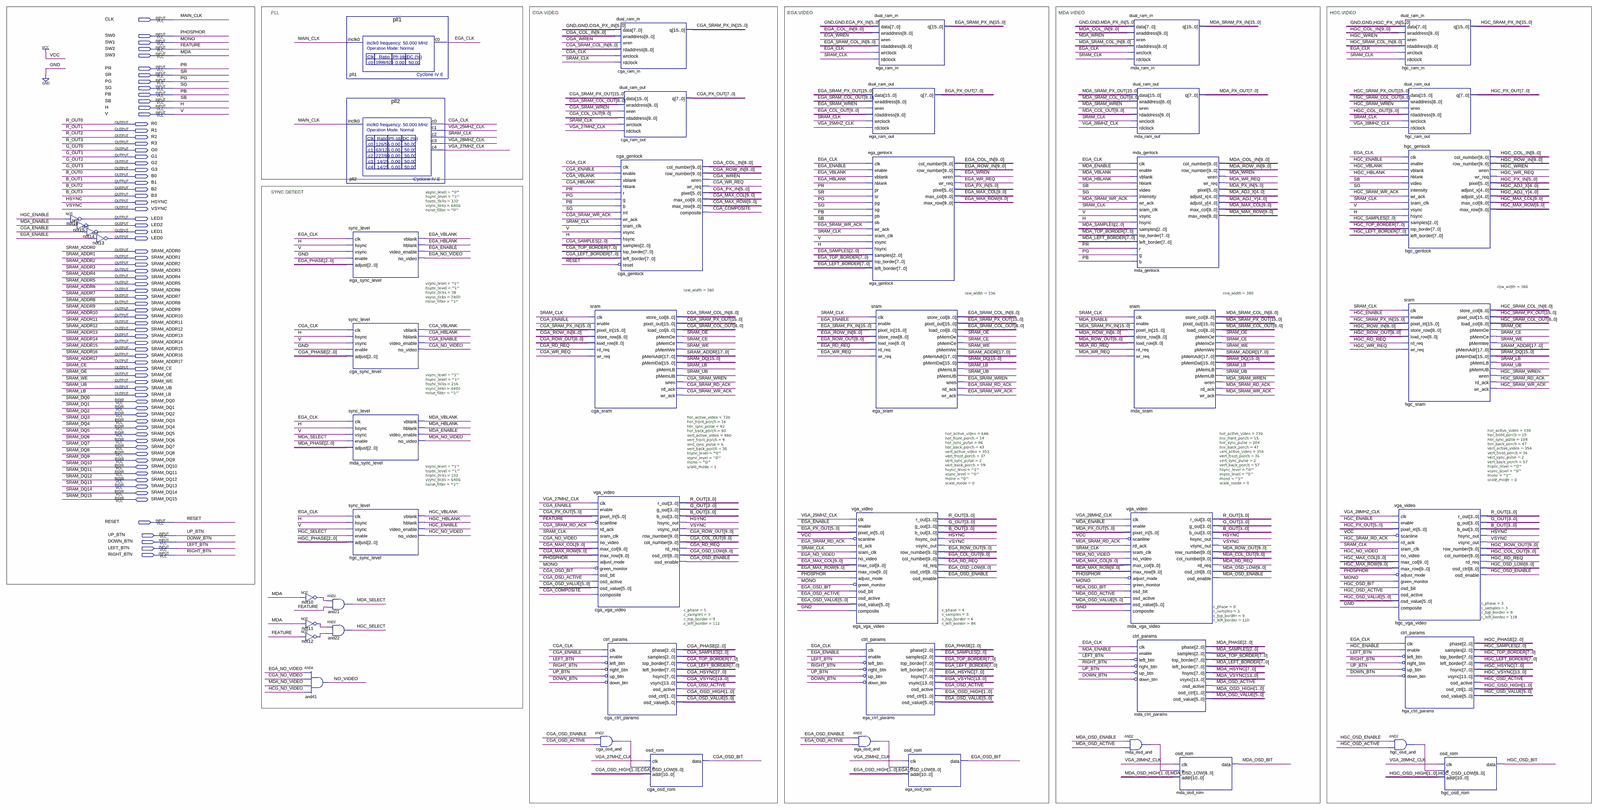
[diagram p0: schematic sheet, whole]
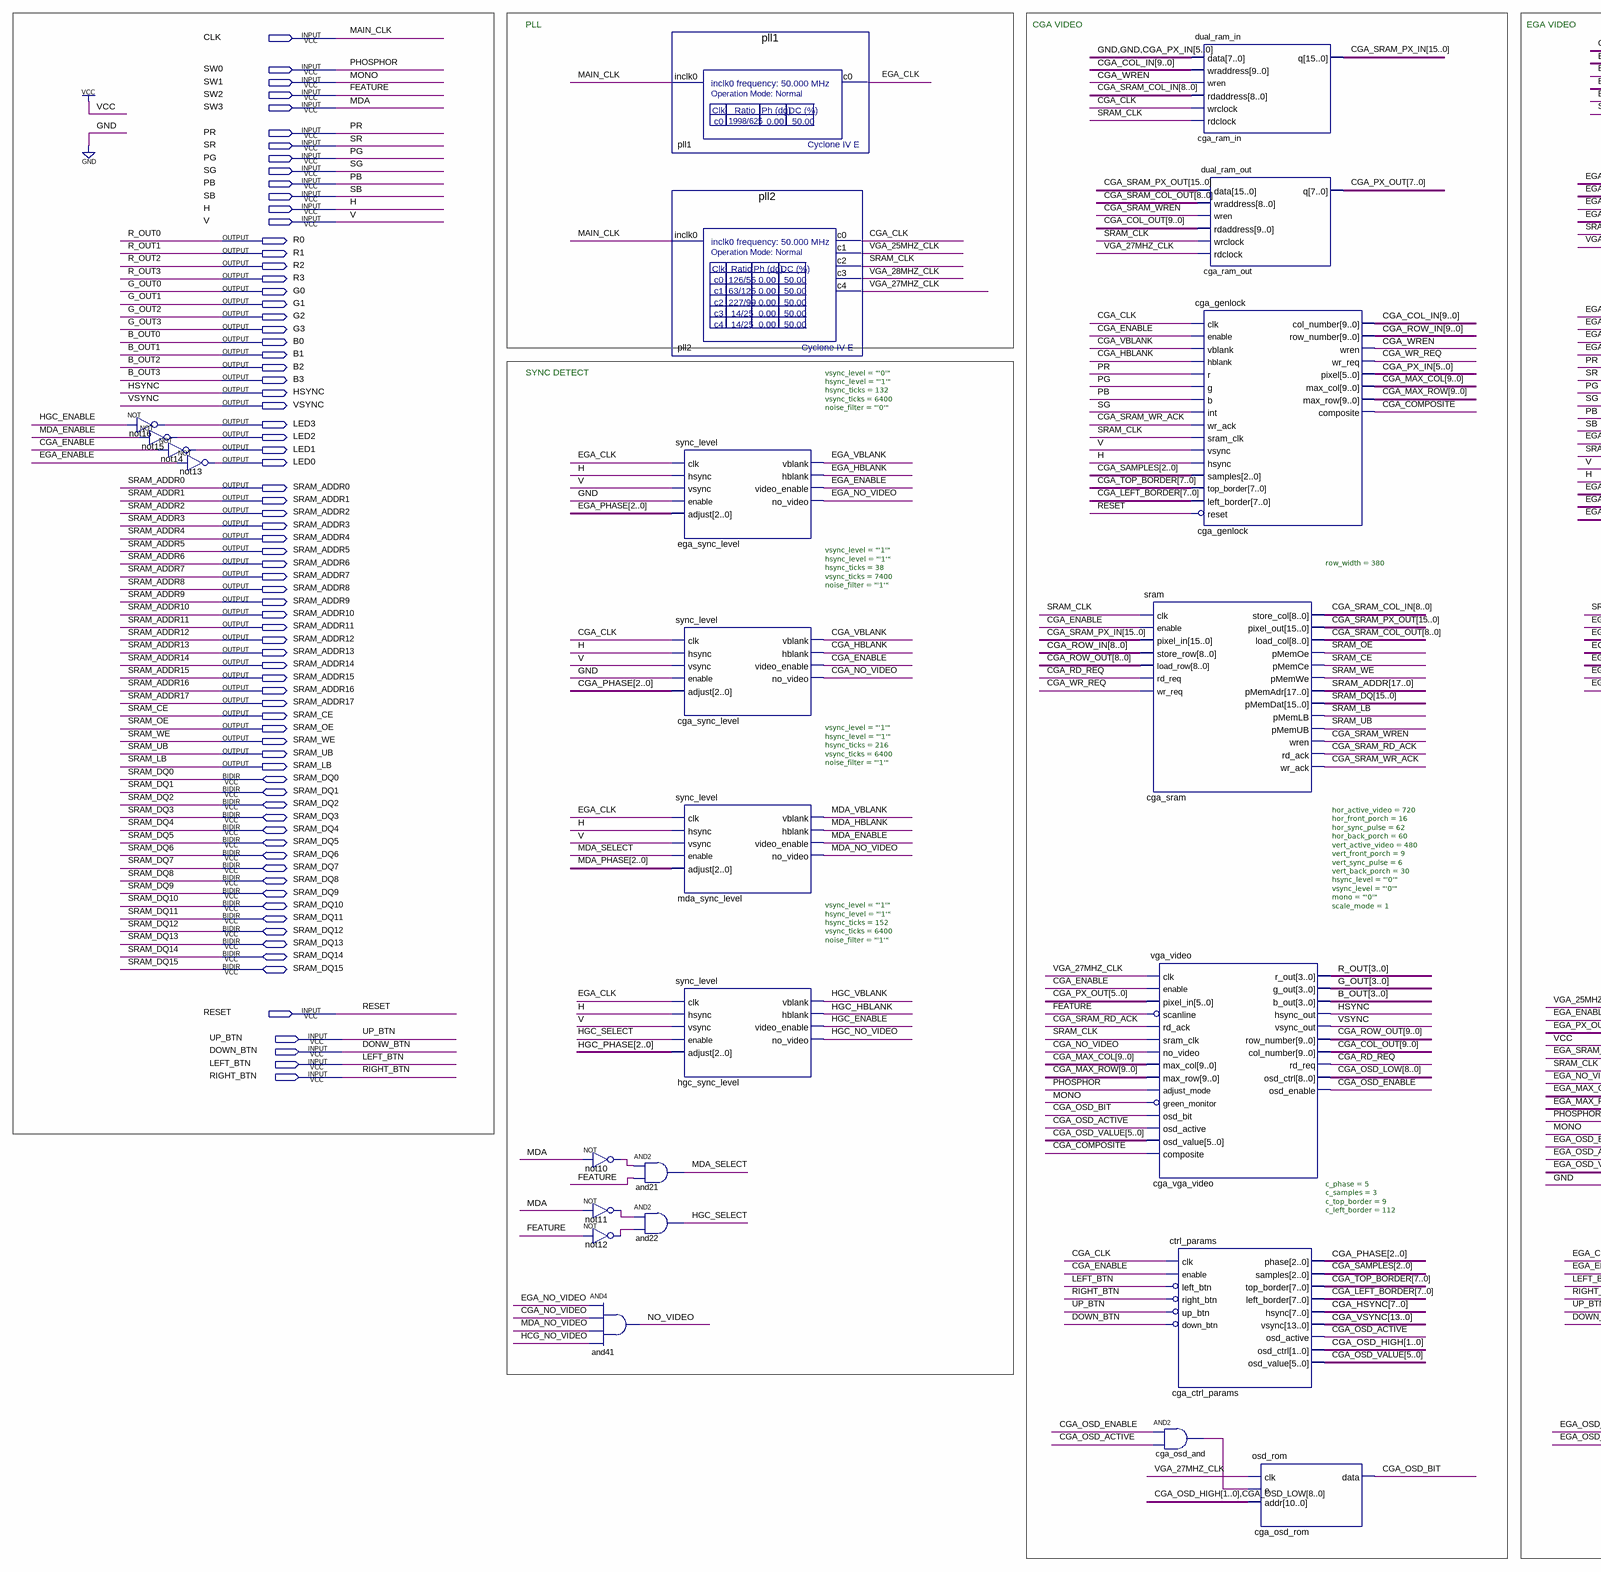
[diagram p1: schematic sheet, left part]
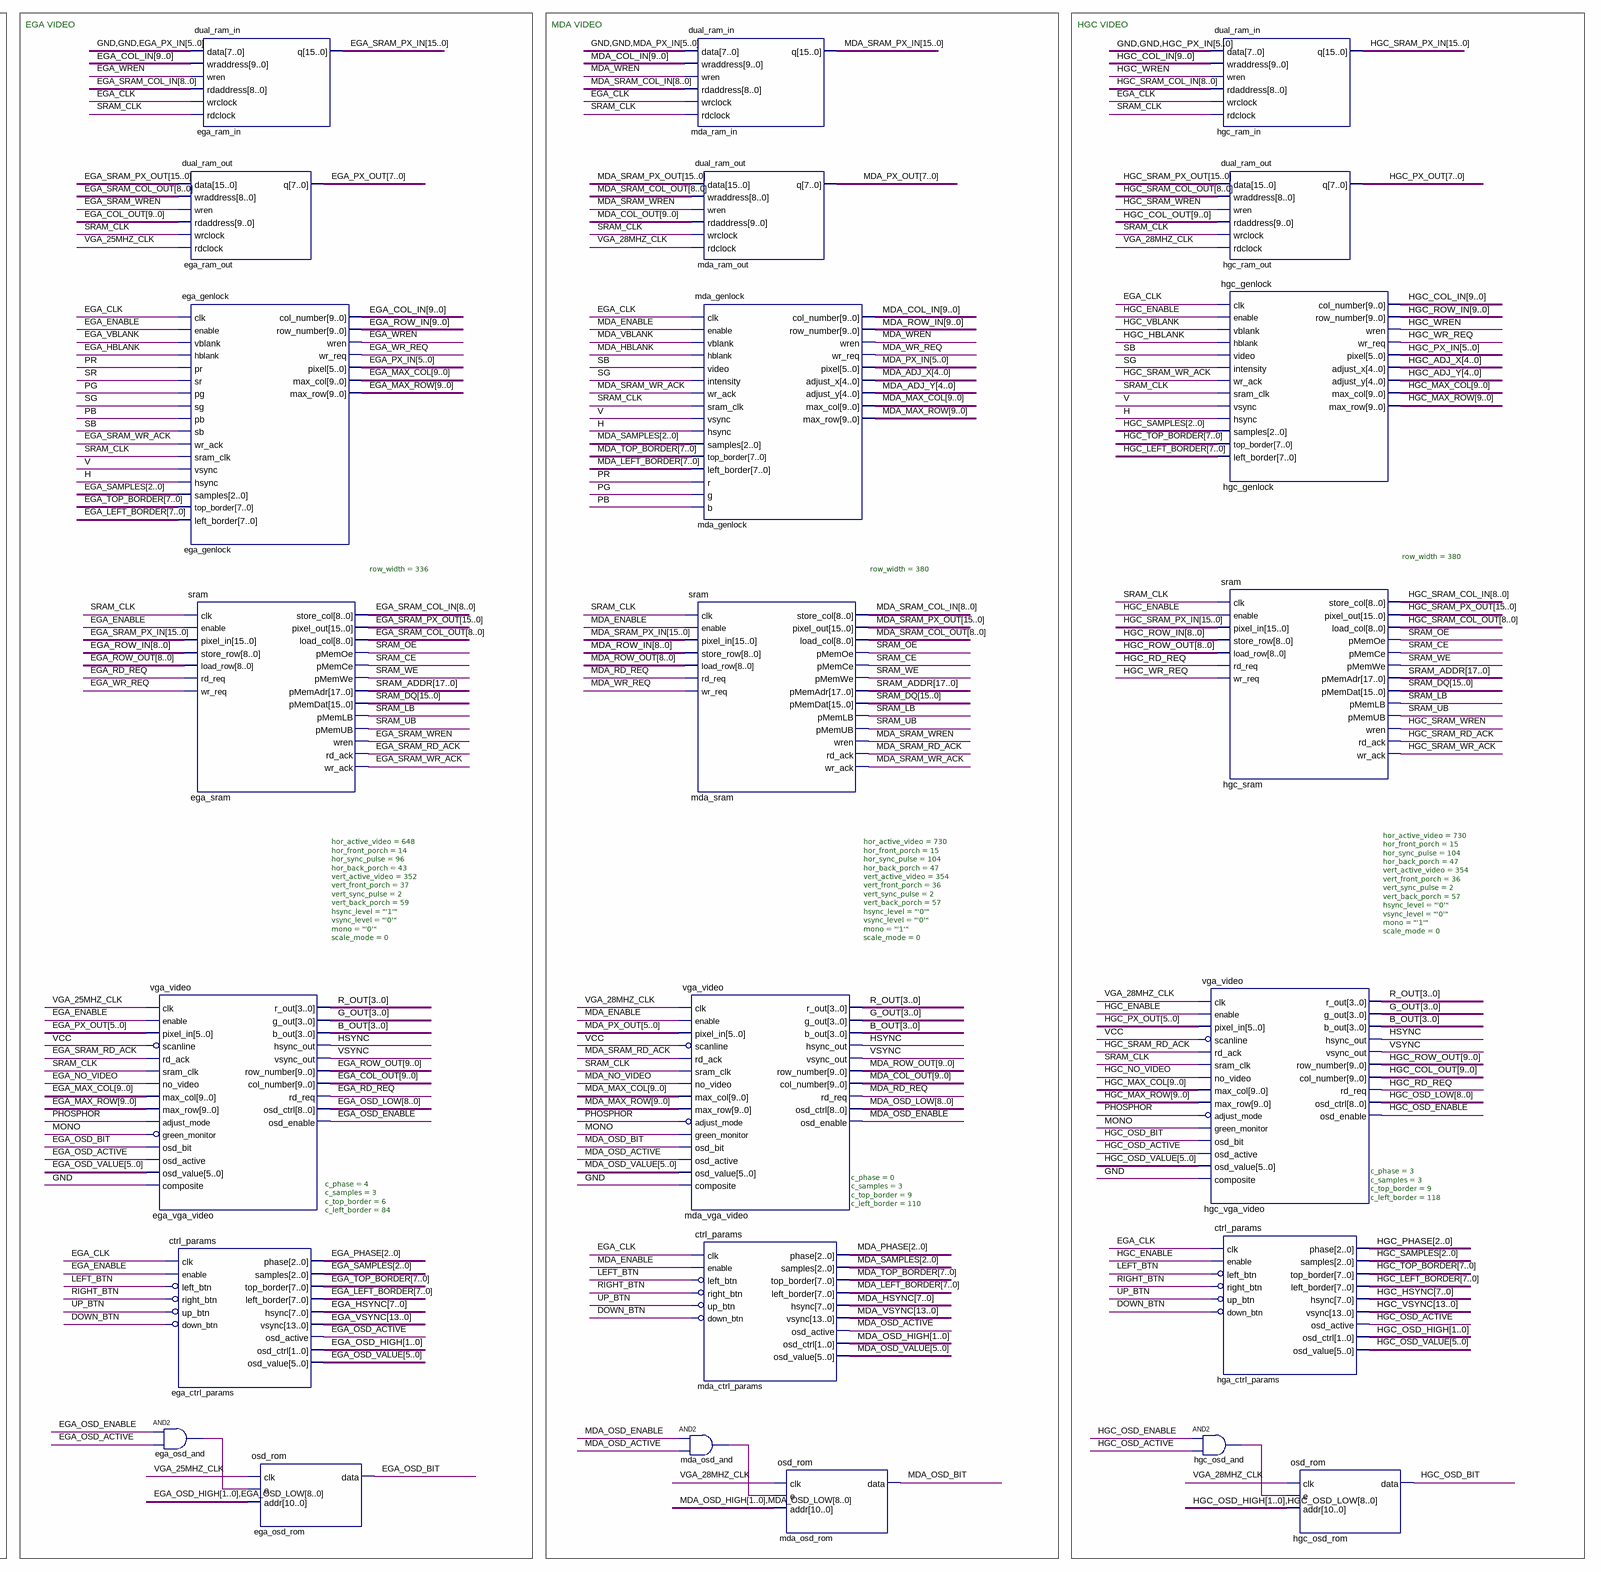
[diagram p2: schematic sheet, right part]
// Quartus schematic schematic.bdf as structural Verilog: 48 symbols, 75 pins
module schematic (
  input  CLK,
  input  SW0,
  input  SW1,
  input  SW2,
  input  SW3,
  input  PR,
  input  SR,
  input  PG,
  input  SG,
  input  PB,
  input  SB,
  input  H,
  input  V,
  input  RESET,
  input  UP_BTN,
  input  DOWN_BTN,
  input  LEFT_BTN,
  input  RIGHT_BTN,
  inout  SRAM_DQ0,
  inout  SRAM_DQ1,
  inout  SRAM_DQ2,
  inout  SRAM_DQ3,
  inout  SRAM_DQ4,
  inout  SRAM_DQ5,
  inout  SRAM_DQ6,
  inout  SRAM_DQ7,
  inout  SRAM_DQ8,
  inout  SRAM_DQ9,
  inout  SRAM_DQ10,
  inout  SRAM_DQ11,
  inout  SRAM_DQ12,
  inout  SRAM_DQ13,
  inout  SRAM_DQ14,
  inout  SRAM_DQ15,
  output R0,
  output R1,
  output R2,
  output R3,
  output G0,
  output G1,
  output G2,
  output G3,
  output B0,
  output B1,
  output B2,
  output B3,
  output HSYNC,
  output VSYNC,
  output LED3,
  output LED2,
  output LED1,
  output LED0,
  output SRAM_ADDR0,
  output SRAM_ADDR1,
  output SRAM_ADDR2,
  output SRAM_ADDR3,
  output SRAM_ADDR4,
  output SRAM_ADDR5,
  output SRAM_ADDR6,
  output SRAM_ADDR7,
  output SRAM_ADDR8,
  output SRAM_ADDR9,
  output SRAM_ADDR10,
  output SRAM_ADDR11,
  output SRAM_ADDR12,
  output SRAM_ADDR13,
  output SRAM_ADDR14,
  output SRAM_ADDR15,
  output SRAM_ADDR16,
  output SRAM_ADDR17,
  output SRAM_CE,
  output SRAM_OE,
  output SRAM_WE,
  output SRAM_UB,
  output SRAM_LB
);

  wire CGA_CLK, CGA_COMPOSITE, CGA_ENABLE, CGA_HBLANK, CGA_NO_VIDEO, CGA_OSD_ACTIVE, cga_osd_and_out,
       CGA_OSD_BIT, CGA_OSD_ENABLE, CGA_RD_REQ, CGA_SRAM_RD_ACK, CGA_SRAM_WR_ACK, CGA_SRAM_WREN, CGA_VBLANK,
       CGA_WR_REQ, CGA_WREN, EGA_CLK, EGA_ENABLE, EGA_HBLANK, EGA_NO_VIDEO, EGA_OSD_ACTIVE, ega_osd_and_out,
       EGA_OSD_BIT, EGA_OSD_ENABLE, EGA_RD_REQ, EGA_SRAM_RD_ACK, EGA_SRAM_WR_ACK, EGA_SRAM_WREN, EGA_VBLANK,
       EGA_WR_REQ, EGA_WREN, HCG_NO_VIDEO, HGC_ENABLE, HGC_HBLANK, HGC_NO_VIDEO, HGC_OSD_ACTIVE,
       hgc_osd_and_out, HGC_OSD_BIT, HGC_OSD_ENABLE, HGC_RD_REQ, HGC_SELECT, HGC_SRAM_RD_ACK,
       HGC_SRAM_WR_ACK, HGC_SRAM_WREN, HGC_VBLANK, HGC_WR_REQ, HGC_WREN, MDA_ENABLE, MDA_HBLANK,
       MDA_NO_VIDEO, MDA_OSD_ACTIVE, mda_osd_and_out, MDA_OSD_BIT, MDA_OSD_ENABLE, MDA_RD_REQ, MDA_SELECT,
       MDA_SRAM_RD_ACK, MDA_SRAM_WR_ACK, MDA_SRAM_WREN, MDA_VBLANK, MDA_WR_REQ, MDA_WREN, NO_VIDEO,
       not10_out, not11_out, not12_out, SRAM_CLK, VGA_25MHZ_CLK, VGA_27MHZ_CLK, VGA_28MHZ_CLK;
  wire [1:0] CGA_OSD_HIGH, EGA_OSD_HIGH, HGC_OSD_HIGH, MDA_OSD_HIGH;
  wire [2:0] CGA_PHASE, CGA_SAMPLES, EGA_PHASE, EGA_SAMPLES, HGC_PHASE, HGC_SAMPLES, MDA_PHASE, MDA_SAMPLES;
  wire [4:0] HGC_ADJ_X, HGC_ADJ_Y, MDA_ADJ_X, MDA_ADJ_Y;
  wire [5:0] CGA_OSD_VALUE, CGA_PX_IN, EGA_OSD_VALUE, EGA_PX_IN, HGC_OSD_VALUE, HGC_PX_IN, MDA_OSD_VALUE,
       MDA_PX_IN;
  wire [7:0] CGA_HSYNC, CGA_LEFT_BORDER, CGA_PX_OUT, CGA_TOP_BORDER, EGA_HSYNC, EGA_LEFT_BORDER, EGA_PX_OUT,
       EGA_TOP_BORDER, HGC_HSYNC, HGC_LEFT_BORDER, HGC_PX_OUT, HGC_TOP_BORDER, MDA_HSYNC, MDA_LEFT_BORDER,
       MDA_PX_OUT, MDA_TOP_BORDER;
  wire [8:0] CGA_OSD_LOW, CGA_SRAM_COL_IN, CGA_SRAM_COL_OUT, EGA_OSD_LOW, EGA_SRAM_COL_IN, EGA_SRAM_COL_OUT,
       HGC_OSD_LOW, HGC_SRAM_COL_IN, HGC_SRAM_COL_OUT, MDA_OSD_LOW, MDA_SRAM_COL_IN, MDA_SRAM_COL_OUT;
  wire [9:0] CGA_COL_IN, CGA_COL_OUT, CGA_MAX_COL, CGA_MAX_ROW, CGA_ROW_IN, CGA_ROW_OUT, EGA_COL_IN,
       EGA_COL_OUT, EGA_MAX_COL, EGA_MAX_ROW, EGA_ROW_IN, EGA_ROW_OUT, HGC_COL_IN, HGC_COL_OUT, HGC_MAX_COL,
       HGC_MAX_ROW, HGC_ROW_IN, HGC_ROW_OUT, MDA_COL_IN, MDA_COL_OUT, MDA_MAX_COL, MDA_MAX_ROW, MDA_ROW_IN,
       MDA_ROW_OUT;
  wire [13:0] CGA_VSYNC, EGA_VSYNC, HGC_VSYNC, MDA_VSYNC;
  wire [15:0] CGA_SRAM_PX_IN, CGA_SRAM_PX_OUT, EGA_SRAM_PX_IN, EGA_SRAM_PX_OUT, HGC_SRAM_PX_IN,
       HGC_SRAM_PX_OUT, MDA_SRAM_PX_IN, MDA_SRAM_PX_OUT;

  not not16 (LED3, HGC_ENABLE);
  not not15 (LED2, MDA_ENABLE);
  not not14 (LED1, CGA_ENABLE);
  not not13 (LED0, EGA_ENABLE);
  not not10 (not10_out, SW3);
  not not11 (not11_out, SW3);
  not not12 (not12_out, SW2);
  and and41 (NO_VIDEO, EGA_NO_VIDEO, CGA_NO_VIDEO, MDA_NO_VIDEO, HCG_NO_VIDEO);
  and and21 (MDA_SELECT, not10_out, SW2);
  and and22 (HGC_SELECT, not11_out, not12_out);
  pll1 pll1 (.inclk0(CLK), .c0(EGA_CLK));
  pll2 pll2 (.inclk0(CLK), .c0(CGA_CLK), .c1(VGA_25MHZ_CLK), .c2(SRAM_CLK), .c3(VGA_28MHZ_CLK), .c4(VGA_27MHZ_CLK));
  sync_level #(.vsync_level("'0'"), .hsync_level("'1'"), .hsync_ticks(132), .vsync_ticks(6400), .noise_filter("'0'")) ega_sync_level (
    .clk(EGA_CLK), .hsync(H), .vsync(V), .enable(1'b0), .adjust(EGA_PHASE), .vblank(EGA_VBLANK),
    .hblank(EGA_HBLANK), .video_enable(EGA_ENABLE), .no_video(EGA_NO_VIDEO));
  sync_level #(.vsync_level("'1'"), .hsync_level("'1'"), .hsync_ticks(38), .vsync_ticks(7400), .noise_filter("'1'")) cga_sync_level (
    .clk(CGA_CLK), .hsync(H), .vsync(V), .enable(1'b0), .adjust(CGA_PHASE), .vblank(CGA_VBLANK),
    .hblank(CGA_HBLANK), .video_enable(CGA_ENABLE), .no_video(CGA_NO_VIDEO));
  sync_level #(.vsync_level("'1'"), .hsync_level("'1'"), .hsync_ticks(216), .vsync_ticks(6400), .noise_filter("'1'")) mda_sync_level (
    .clk(EGA_CLK), .hsync(H), .vsync(V), .enable(MDA_SELECT), .adjust(MDA_PHASE), .vblank(MDA_VBLANK),
    .hblank(MDA_HBLANK), .video_enable(MDA_ENABLE), .no_video(MDA_NO_VIDEO));
  sync_level #(.vsync_level("'1'"), .hsync_level("'1'"), .hsync_ticks(152), .vsync_ticks(6400), .noise_filter("'1'")) hgc_sync_level (
    .clk(EGA_CLK), .hsync(H), .vsync(V), .enable(HGC_SELECT), .adjust(HGC_PHASE), .vblank(HGC_VBLANK),
    .hblank(HGC_HBLANK), .video_enable(HGC_ENABLE), .no_video(HGC_NO_VIDEO));
  sram #(.row_width(380)) cga_sram (
    .clk(SRAM_CLK), .enable(CGA_ENABLE), .pixel_in(CGA_SRAM_PX_IN), .store_row(CGA_ROW_IN[8:0]),
    .load_row(CGA_ROW_OUT[8:0]), .rd_req(CGA_RD_REQ), .wr_req(CGA_WR_REQ), .store_col(CGA_SRAM_COL_IN),
    .pixel_out(CGA_SRAM_PX_OUT), .load_col(CGA_SRAM_COL_OUT), .pMemOe(SRAM_OE), .pMemCe(SRAM_CE),
    .pMemWe(SRAM_WE),
    .pMemAdr({SRAM_ADDR17, SRAM_ADDR16, SRAM_ADDR15, SRAM_ADDR14, SRAM_ADDR13, SRAM_ADDR12, SRAM_ADDR11, SRAM_ADDR10, SRAM_ADDR9, SRAM_ADDR8, SRAM_ADDR7, SRAM_ADDR6, SRAM_ADDR5, SRAM_ADDR4, SRAM_ADDR3, SRAM_ADDR2, SRAM_ADDR1, SRAM_ADDR0}),
    .pMemLB(SRAM_LB), .pMemUB(SRAM_UB), .wren(CGA_SRAM_WREN), .rd_ack(CGA_SRAM_RD_ACK),
    .wr_ack(CGA_SRAM_WR_ACK),
    .pMemDat({SRAM_DQ15, SRAM_DQ14, SRAM_DQ13, SRAM_DQ12, SRAM_DQ11, SRAM_DQ10, SRAM_DQ9, SRAM_DQ8, SRAM_DQ7, SRAM_DQ6, SRAM_DQ5, SRAM_DQ4, SRAM_DQ3, SRAM_DQ2, SRAM_DQ1, SRAM_DQ0}));
  vga_video #(.hor_active_video(720), .hor_front_porch(16), .hor_sync_pulse(62), .hor_back_porch(60), .vert_active_video(480), .vert_front_porch(9), .vert_sync_pulse(6), .vert_back_porch(30), .hsync_level("'0'"), .vsync_level("'0'"), .mono("'0'"), .scale_mode(1)) cga_vga_video (
    .clk(VGA_27MHZ_CLK), .enable(CGA_ENABLE), .pixel_in(CGA_PX_OUT[5:0]), .scanline(~SW2),
    .rd_ack(CGA_SRAM_RD_ACK), .sram_clk(SRAM_CLK), .no_video(CGA_NO_VIDEO), .max_col(CGA_MAX_COL),
    .max_row(CGA_MAX_ROW), .adjust_mode(SW0), .green_monitor(~SW1), .osd_bit(CGA_OSD_BIT),
    .osd_active(CGA_OSD_ACTIVE), .osd_value(CGA_OSD_VALUE), .composite(CGA_COMPOSITE),
    .r_out({R3, R2, R1, R0}), .g_out({G3, G2, G1, G0}), .b_out({B3, B2, B1, B0}), .hsync_out(HSYNC),
    .vsync_out(VSYNC), .row_number(CGA_ROW_OUT), .col_number(CGA_COL_OUT), .rd_req(CGA_RD_REQ),
    .osd_ctrl(CGA_OSD_LOW), .osd_enable(CGA_OSD_ENABLE));
  dual_ram_in cga_ram_in (
    .data({2'b00, CGA_PX_IN}), .wraddress(CGA_COL_IN), .wren(CGA_WREN), .rdaddress(CGA_SRAM_COL_IN),
    .wrclock(CGA_CLK), .rdclock(SRAM_CLK), .q(CGA_SRAM_PX_IN));
  dual_ram_out cga_ram_out (
    .data(CGA_SRAM_PX_OUT), .wraddress(CGA_SRAM_COL_OUT), .wren(CGA_SRAM_WREN), .rdaddress(CGA_COL_OUT),
    .wrclock(SRAM_CLK), .rdclock(VGA_27MHZ_CLK), .q(CGA_PX_OUT));
  cga_genlock cga_genlock (
    .clk(CGA_CLK), .enable(CGA_ENABLE), .vblank(CGA_VBLANK), .hblank(CGA_HBLANK), .r(PR), .g(PG), .b(PB),
    .\int (SG), .wr_ack(CGA_SRAM_WR_ACK), .sram_clk(SRAM_CLK), .vsync(V), .hsync(H), .samples(CGA_SAMPLES),
    .top_border(CGA_TOP_BORDER), .left_border(CGA_LEFT_BORDER), .reset(~RESET), .col_number(CGA_COL_IN),
    .row_number(CGA_ROW_IN), .wren(CGA_WREN), .wr_req(CGA_WR_REQ), .pixel(CGA_PX_IN), .max_col(CGA_MAX_COL),
    .max_row(CGA_MAX_ROW), .composite(CGA_COMPOSITE));
  ctrl_params #(.c_phase(5), .c_samples(3), .c_top_border(9), .c_left_border(112)) cga_ctrl_params (
    .clk(CGA_CLK), .enable(CGA_ENABLE), .left_btn(~LEFT_BTN), .right_btn(~RIGHT_BTN), .up_btn(~UP_BTN),
    .down_btn(~DOWN_BTN), .phase(CGA_PHASE), .samples(CGA_SAMPLES), .top_border(CGA_TOP_BORDER),
    .left_border(CGA_LEFT_BORDER), .hsync(CGA_HSYNC), .vsync(CGA_VSYNC), .osd_active(CGA_OSD_ACTIVE),
    .osd_ctrl(CGA_OSD_HIGH), .osd_value(CGA_OSD_VALUE));
  and cga_osd_and (cga_osd_and_out, CGA_OSD_ENABLE, CGA_OSD_ACTIVE);
  osd_rom cga_osd_rom (
    .clk(VGA_27MHZ_CLK), .e(cga_osd_and_out), .addr({CGA_OSD_HIGH, CGA_OSD_LOW}), .data(CGA_OSD_BIT));
  vga_video #(.hor_active_video(648), .hor_front_porch(14), .hor_sync_pulse(96), .hor_back_porch(43), .vert_active_video(352), .vert_front_porch(37), .vert_sync_pulse(2), .vert_back_porch(59), .hsync_level("'1'"), .vsync_level("'0'"), .mono("'0'"), .scale_mode(0)) ega_vga_video (
    .clk(VGA_25MHZ_CLK), .enable(EGA_ENABLE), .pixel_in(EGA_PX_OUT[5:0]), .scanline(~1'b1),
    .rd_ack(EGA_SRAM_RD_ACK), .sram_clk(SRAM_CLK), .no_video(EGA_NO_VIDEO), .max_col(EGA_MAX_COL),
    .max_row(EGA_MAX_ROW), .adjust_mode(SW0), .green_monitor(~SW1), .osd_bit(EGA_OSD_BIT),
    .osd_active(EGA_OSD_ACTIVE), .osd_value(EGA_OSD_VALUE), .composite(1'b0), .r_out({R3, R2, R1, R0}),
    .g_out({G3, G2, G1, G0}), .b_out({B3, B2, B1, B0}), .hsync_out(HSYNC), .vsync_out(VSYNC),
    .row_number(EGA_ROW_OUT), .col_number(EGA_COL_OUT), .rd_req(EGA_RD_REQ), .osd_ctrl(EGA_OSD_LOW),
    .osd_enable(EGA_OSD_ENABLE));
  and ega_osd_and (ega_osd_and_out, EGA_OSD_ENABLE, EGA_OSD_ACTIVE);
  dual_ram_in ega_ram_in (
    .data({2'b00, EGA_PX_IN}), .wraddress(EGA_COL_IN), .wren(EGA_WREN), .rdaddress(EGA_SRAM_COL_IN),
    .wrclock(EGA_CLK), .rdclock(SRAM_CLK), .q(EGA_SRAM_PX_IN));
  dual_ram_out ega_ram_out (
    .data(EGA_SRAM_PX_OUT), .wraddress(EGA_SRAM_COL_OUT), .wren(EGA_SRAM_WREN), .rdaddress(EGA_COL_OUT),
    .wrclock(SRAM_CLK), .rdclock(VGA_25MHZ_CLK), .q(EGA_PX_OUT));
  ega_genlock ega_genlock (
    .clk(EGA_CLK), .enable(EGA_ENABLE), .vblank(EGA_VBLANK), .hblank(EGA_HBLANK), .pr(PR), .sr(SR), .pg(PG),
    .sg(SG), .pb(PB), .sb(SB), .wr_ack(EGA_SRAM_WR_ACK), .sram_clk(SRAM_CLK), .vsync(V), .hsync(H),
    .samples(EGA_SAMPLES), .top_border(EGA_TOP_BORDER), .left_border(EGA_LEFT_BORDER),
    .col_number(EGA_COL_IN), .row_number(EGA_ROW_IN), .wren(EGA_WREN), .wr_req(EGA_WR_REQ),
    .pixel(EGA_PX_IN), .max_col(EGA_MAX_COL), .max_row(EGA_MAX_ROW));
  sram #(.row_width(336)) ega_sram (
    .clk(SRAM_CLK), .enable(EGA_ENABLE), .pixel_in(EGA_SRAM_PX_IN), .store_row(EGA_ROW_IN[8:0]),
    .load_row(EGA_ROW_OUT[8:0]), .rd_req(EGA_RD_REQ), .wr_req(EGA_WR_REQ), .store_col(EGA_SRAM_COL_IN),
    .pixel_out(EGA_SRAM_PX_OUT), .load_col(EGA_SRAM_COL_OUT), .pMemOe(SRAM_OE), .pMemCe(SRAM_CE),
    .pMemWe(SRAM_WE),
    .pMemAdr({SRAM_ADDR17, SRAM_ADDR16, SRAM_ADDR15, SRAM_ADDR14, SRAM_ADDR13, SRAM_ADDR12, SRAM_ADDR11, SRAM_ADDR10, SRAM_ADDR9, SRAM_ADDR8, SRAM_ADDR7, SRAM_ADDR6, SRAM_ADDR5, SRAM_ADDR4, SRAM_ADDR3, SRAM_ADDR2, SRAM_ADDR1, SRAM_ADDR0}),
    .pMemLB(SRAM_LB), .pMemUB(SRAM_UB), .wren(EGA_SRAM_WREN), .rd_ack(EGA_SRAM_RD_ACK),
    .wr_ack(EGA_SRAM_WR_ACK),
    .pMemDat({SRAM_DQ15, SRAM_DQ14, SRAM_DQ13, SRAM_DQ12, SRAM_DQ11, SRAM_DQ10, SRAM_DQ9, SRAM_DQ8, SRAM_DQ7, SRAM_DQ6, SRAM_DQ5, SRAM_DQ4, SRAM_DQ3, SRAM_DQ2, SRAM_DQ1, SRAM_DQ0}));
  ctrl_params #(.c_phase(4), .c_samples(3), .c_top_border(6), .c_left_border(84)) ega_ctrl_params (
    .clk(EGA_CLK), .enable(EGA_ENABLE), .left_btn(~LEFT_BTN), .right_btn(~RIGHT_BTN), .up_btn(~UP_BTN),
    .down_btn(~DOWN_BTN), .phase(EGA_PHASE), .samples(EGA_SAMPLES), .top_border(EGA_TOP_BORDER),
    .left_border(EGA_LEFT_BORDER), .hsync(EGA_HSYNC), .vsync(EGA_VSYNC), .osd_active(EGA_OSD_ACTIVE),
    .osd_ctrl(EGA_OSD_HIGH), .osd_value(EGA_OSD_VALUE));
  osd_rom ega_osd_rom (
    .clk(VGA_25MHZ_CLK), .e(ega_osd_and_out), .addr({EGA_OSD_HIGH, EGA_OSD_LOW}), .data(EGA_OSD_BIT));
  dual_ram_in mda_ram_in (
    .data({2'b00, MDA_PX_IN}), .wraddress(MDA_COL_IN), .wren(MDA_WREN), .rdaddress(MDA_SRAM_COL_IN),
    .wrclock(EGA_CLK), .rdclock(SRAM_CLK), .q(MDA_SRAM_PX_IN));
  dual_ram_out mda_ram_out (
    .data(MDA_SRAM_PX_OUT), .wraddress(MDA_SRAM_COL_OUT), .wren(MDA_SRAM_WREN), .rdaddress(MDA_COL_OUT),
    .wrclock(SRAM_CLK), .rdclock(VGA_28MHZ_CLK), .q(MDA_PX_OUT));
  mda_genlock mda_genlock (
    .clk(EGA_CLK), .enable(MDA_ENABLE), .vblank(MDA_VBLANK), .hblank(MDA_HBLANK), .video(SB), .intensity(SG),
    .wr_ack(MDA_SRAM_WR_ACK), .sram_clk(SRAM_CLK), .vsync(V), .hsync(H), .samples(MDA_SAMPLES),
    .top_border(MDA_TOP_BORDER), .left_border(MDA_LEFT_BORDER), .r(PR), .g(PG), .b(PB),
    .col_number(MDA_COL_IN), .row_number(MDA_ROW_IN), .wren(MDA_WREN), .wr_req(MDA_WR_REQ),
    .pixel(MDA_PX_IN), .adjust_x(MDA_ADJ_X), .adjust_y(MDA_ADJ_Y), .max_col(MDA_MAX_COL),
    .max_row(MDA_MAX_ROW));
  sram #(.row_width(380)) mda_sram (
    .clk(SRAM_CLK), .enable(MDA_ENABLE), .pixel_in(MDA_SRAM_PX_IN), .store_row(MDA_ROW_IN[8:0]),
    .load_row(MDA_ROW_OUT[8:0]), .rd_req(MDA_RD_REQ), .wr_req(MDA_WR_REQ), .store_col(MDA_SRAM_COL_IN),
    .pixel_out(MDA_SRAM_PX_OUT), .load_col(MDA_SRAM_COL_OUT), .pMemOe(SRAM_OE), .pMemCe(SRAM_CE),
    .pMemWe(SRAM_WE),
    .pMemAdr({SRAM_ADDR17, SRAM_ADDR16, SRAM_ADDR15, SRAM_ADDR14, SRAM_ADDR13, SRAM_ADDR12, SRAM_ADDR11, SRAM_ADDR10, SRAM_ADDR9, SRAM_ADDR8, SRAM_ADDR7, SRAM_ADDR6, SRAM_ADDR5, SRAM_ADDR4, SRAM_ADDR3, SRAM_ADDR2, SRAM_ADDR1, SRAM_ADDR0}),
    .pMemLB(SRAM_LB), .pMemUB(SRAM_UB), .wren(MDA_SRAM_WREN), .rd_ack(MDA_SRAM_RD_ACK),
    .wr_ack(MDA_SRAM_WR_ACK),
    .pMemDat({SRAM_DQ15, SRAM_DQ14, SRAM_DQ13, SRAM_DQ12, SRAM_DQ11, SRAM_DQ10, SRAM_DQ9, SRAM_DQ8, SRAM_DQ7, SRAM_DQ6, SRAM_DQ5, SRAM_DQ4, SRAM_DQ3, SRAM_DQ2, SRAM_DQ1, SRAM_DQ0}));
  vga_video #(.hor_active_video(730), .hor_front_porch(15), .hor_sync_pulse(104), .hor_back_porch(47), .vert_active_video(354), .vert_front_porch(36), .vert_sync_pulse(2), .vert_back_porch(57), .hsync_level("'0'"), .vsync_level("'0'"), .mono("'1'"), .scale_mode(0)) mda_vga_video (
    .clk(VGA_28MHZ_CLK), .enable(MDA_ENABLE), .pixel_in(MDA_PX_OUT[5:0]), .scanline(~1'b1),
    .rd_ack(MDA_SRAM_RD_ACK), .sram_clk(SRAM_CLK), .no_video(MDA_NO_VIDEO), .max_col(MDA_MAX_COL),
    .max_row(MDA_MAX_ROW), .adjust_mode(~SW0), .green_monitor(SW1), .osd_bit(MDA_OSD_BIT),
    .osd_active(MDA_OSD_ACTIVE), .osd_value(MDA_OSD_VALUE), .composite(1'b0), .r_out({R3, R2, R1, R0}),
    .g_out({G3, G2, G1, G0}), .b_out({B3, B2, B1, B0}), .hsync_out(HSYNC), .vsync_out(VSYNC),
    .row_number(MDA_ROW_OUT), .col_number(MDA_COL_OUT), .rd_req(MDA_RD_REQ), .osd_ctrl(MDA_OSD_LOW),
    .osd_enable(MDA_OSD_ENABLE));
  ctrl_params #(.c_phase(0), .c_samples(3), .c_top_border(9), .c_left_border(110)) mda_ctrl_params (
    .clk(EGA_CLK), .enable(MDA_ENABLE), .left_btn(~LEFT_BTN), .right_btn(~RIGHT_BTN), .up_btn(~UP_BTN),
    .down_btn(~DOWN_BTN), .phase(MDA_PHASE), .samples(MDA_SAMPLES), .top_border(MDA_TOP_BORDER),
    .left_border(MDA_LEFT_BORDER), .hsync(MDA_HSYNC), .vsync(MDA_VSYNC), .osd_active(MDA_OSD_ACTIVE),
    .osd_ctrl(MDA_OSD_HIGH), .osd_value(MDA_OSD_VALUE));
  and mda_osd_and (mda_osd_and_out, MDA_OSD_ENABLE, MDA_OSD_ACTIVE);
  osd_rom mda_osd_rom (
    .clk(VGA_28MHZ_CLK), .e(mda_osd_and_out), .addr({MDA_OSD_HIGH, MDA_OSD_LOW}), .data(MDA_OSD_BIT));
  dual_ram_in hgc_ram_in (
    .data({2'b00, HGC_PX_IN}), .wraddress(HGC_COL_IN), .wren(HGC_WREN), .rdaddress(HGC_SRAM_COL_IN),
    .wrclock(EGA_CLK), .rdclock(SRAM_CLK), .q(HGC_SRAM_PX_IN));
  dual_ram_out hgc_ram_out (
    .data(HGC_SRAM_PX_OUT), .wraddress(HGC_SRAM_COL_OUT), .wren(HGC_SRAM_WREN), .rdaddress(HGC_COL_OUT),
    .wrclock(SRAM_CLK), .rdclock(VGA_28MHZ_CLK), .q(HGC_PX_OUT));
  hgc_genlock hgc_genlock (
    .clk(EGA_CLK), .enable(HGC_ENABLE), .vblank(HGC_VBLANK), .hblank(HGC_HBLANK), .video(SB), .intensity(SG),
    .wr_ack(HGC_SRAM_WR_ACK), .sram_clk(SRAM_CLK), .vsync(V), .hsync(H), .samples(HGC_SAMPLES),
    .top_border(HGC_TOP_BORDER), .left_border(HGC_LEFT_BORDER), .col_number(HGC_COL_IN),
    .row_number(HGC_ROW_IN), .wren(HGC_WREN), .wr_req(HGC_WR_REQ), .pixel(HGC_PX_IN), .adjust_x(HGC_ADJ_X),
    .adjust_y(HGC_ADJ_Y), .max_col(HGC_MAX_COL), .max_row(HGC_MAX_ROW));
  sram #(.row_width(380)) hgc_sram (
    .clk(SRAM_CLK), .enable(HGC_ENABLE), .pixel_in(HGC_SRAM_PX_IN), .store_row(HGC_ROW_IN[8:0]),
    .load_row(HGC_ROW_OUT[8:0]), .rd_req(HGC_RD_REQ), .wr_req(HGC_WR_REQ), .store_col(HGC_SRAM_COL_IN),
    .pixel_out(HGC_SRAM_PX_OUT), .load_col(HGC_SRAM_COL_OUT), .pMemOe(SRAM_OE), .pMemCe(SRAM_CE),
    .pMemWe(SRAM_WE),
    .pMemAdr({SRAM_ADDR17, SRAM_ADDR16, SRAM_ADDR15, SRAM_ADDR14, SRAM_ADDR13, SRAM_ADDR12, SRAM_ADDR11, SRAM_ADDR10, SRAM_ADDR9, SRAM_ADDR8, SRAM_ADDR7, SRAM_ADDR6, SRAM_ADDR5, SRAM_ADDR4, SRAM_ADDR3, SRAM_ADDR2, SRAM_ADDR1, SRAM_ADDR0}),
    .pMemLB(SRAM_LB), .pMemUB(SRAM_UB), .wren(HGC_SRAM_WREN), .rd_ack(HGC_SRAM_RD_ACK),
    .wr_ack(HGC_SRAM_WR_ACK),
    .pMemDat({SRAM_DQ15, SRAM_DQ14, SRAM_DQ13, SRAM_DQ12, SRAM_DQ11, SRAM_DQ10, SRAM_DQ9, SRAM_DQ8, SRAM_DQ7, SRAM_DQ6, SRAM_DQ5, SRAM_DQ4, SRAM_DQ3, SRAM_DQ2, SRAM_DQ1, SRAM_DQ0}));
  vga_video #(.hor_active_video(730), .hor_front_porch(15), .hor_sync_pulse(104), .hor_back_porch(47), .vert_active_video(354), .vert_front_porch(36), .vert_sync_pulse(2), .vert_back_porch(57), .hsync_level("'0'"), .vsync_level("'0'"), .mono("'1'"), .scale_mode(0)) hgc_vga_video (
    .clk(VGA_28MHZ_CLK), .enable(HGC_ENABLE), .pixel_in(HGC_PX_OUT[5:0]), .scanline(~1'b1),
    .rd_ack(HGC_SRAM_RD_ACK), .sram_clk(SRAM_CLK), .no_video(HGC_NO_VIDEO), .max_col(HGC_MAX_COL),
    .max_row(HGC_MAX_ROW), .adjust_mode(~SW0), .green_monitor(SW1), .osd_bit(HGC_OSD_BIT),
    .osd_active(HGC_OSD_ACTIVE), .osd_value(HGC_OSD_VALUE), .composite(1'b0), .r_out({R3, R2, R1, R0}),
    .g_out({G3, G2, G1, G0}), .b_out({B3, B2, B1, B0}), .hsync_out(HSYNC), .vsync_out(VSYNC),
    .row_number(HGC_ROW_OUT), .col_number(HGC_COL_OUT), .rd_req(HGC_RD_REQ), .osd_ctrl(HGC_OSD_LOW),
    .osd_enable(HGC_OSD_ENABLE));
  ctrl_params #(.c_phase(3), .c_samples(3), .c_top_border(9), .c_left_border(118)) hga_ctrl_params (
    .clk(EGA_CLK), .enable(HGC_ENABLE), .left_btn(~LEFT_BTN), .right_btn(~RIGHT_BTN), .up_btn(~UP_BTN),
    .down_btn(~DOWN_BTN), .phase(HGC_PHASE), .samples(HGC_SAMPLES), .top_border(HGC_TOP_BORDER),
    .left_border(HGC_LEFT_BORDER), .hsync(HGC_HSYNC), .vsync(HGC_VSYNC), .osd_active(HGC_OSD_ACTIVE),
    .osd_ctrl(HGC_OSD_HIGH), .osd_value(HGC_OSD_VALUE));
  and hgc_osd_and (hgc_osd_and_out, HGC_OSD_ENABLE, HGC_OSD_ACTIVE);
  osd_rom hgc_osd_rom (
    .clk(VGA_28MHZ_CLK), .e(hgc_osd_and_out), .addr({HGC_OSD_HIGH, HGC_OSD_LOW}), .data(HGC_OSD_BIT));

  // Other names for the same wires on the sheet: B_OUT[3:0] = {B3, B2, B1, B0}; B_OUT0 = B0; B_OUT1 = B1; B_OUT2 = B2;
  //   B_OUT3 = B3; DONW_BTN = DOWN_BTN; FEATURE = SW2; G_OUT[3:0] = {G3, G2, G1, G0}; G_OUT0 = G0; G_OUT1 = G1;
  //   G_OUT2 = G2; G_OUT3 = G3; MAIN_CLK = CLK; MDA = SW3; MONO = SW1; PHOSPHOR = SW0; R_OUT[3:0] = {R3, R2, R1, R0};
  //   R_OUT0 = R0; R_OUT1 = R1; R_OUT2 = R2; R_OUT3 = R3

  // Notes on the sheet:
  //   PLL
  //   CGA VIDEO
  //   EGA VIDEO
  //   MDA VIDEO
  //   HGC VIDEO
  //   SYNC DETECT
endmodule
